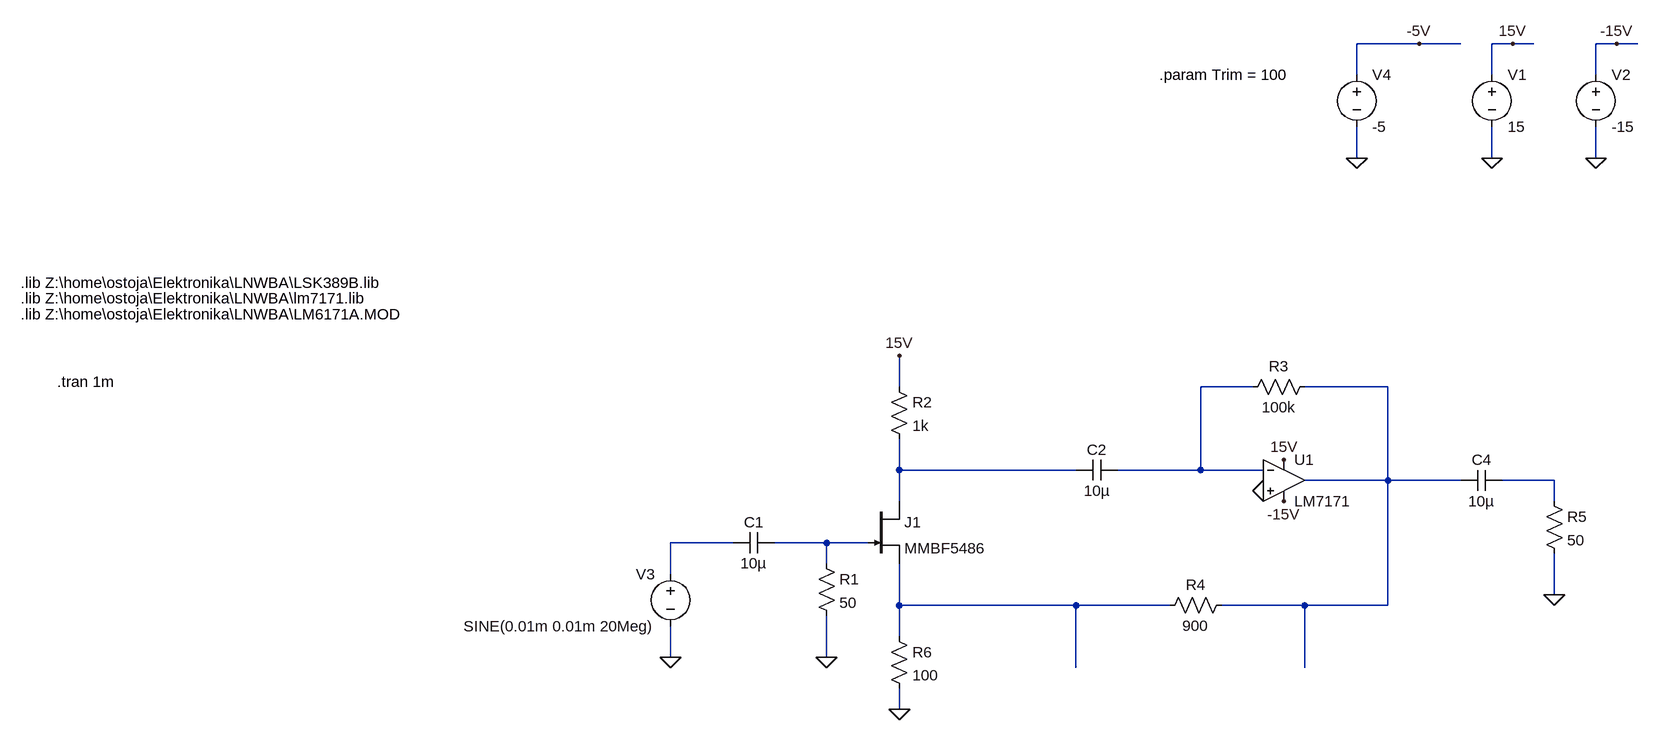
[diagram p0: schematic LNWBA_j111.asc]
LNWBA_j111.asc, the LTspice schematic file:
Version 4
SHEET 1 2516 804
WIRE 960 -592 864 -592
WIRE 1024 -592 960 -592
WIRE 1104 -592 1072 -592
WIRE 1136 -592 1104 -592
WIRE 1264 -592 1232 -592
WIRE 1296 -592 1264 -592
WIRE 864 -544 864 -592
WIRE 1072 -544 1072 -592
WIRE 1232 -544 1232 -592
WIRE 864 -416 864 -464
WIRE 1072 -416 1072 -464
WIRE 1232 -416 1232 -464
WIRE 160 -64 160 -112
WIRE 704 -64 624 -64
WIRE 912 -64 784 -64
WIRE 160 64 160 16
WIRE 432 64 160 64
WIRE 624 64 624 -64
WIRE 624 64 496 64
WIRE 720 64 624 64
WIRE 912 80 912 -64
WIRE 912 80 784 80
WIRE 1024 80 912 80
WIRE 1168 80 1088 80
WIRE 160 112 160 64
WIRE 1168 112 1168 80
WIRE -96 176 -192 176
WIRE 48 176 -32 176
WIRE 112 176 48 176
WIRE 48 208 48 176
WIRE -192 224 -192 176
WIRE 1168 256 1168 192
WIRE 160 272 160 208
WIRE 432 272 160 272
WIRE 576 272 432 272
WIRE 784 272 656 272
WIRE 912 272 912 80
WIRE 912 272 784 272
WIRE 160 320 160 272
WIRE -192 352 -192 304
WIRE 48 352 48 288
WIRE 432 368 432 272
WIRE 784 368 784 272
WIRE 160 432 160 400
FLAG 1104 -592 15V
FLAG 1264 -592 -15V
FLAG 1232 -416 0
FLAG 1072 -416 0
FLAG 160 -112 15V
FLAG -192 352 0
FLAG 752 48 15V
FLAG 752 112 -15V
FLAG 960 -592 -5V
FLAG 864 -416 0
FLAG 48 352 0
FLAG 160 432 0
FLAG 720 96 0
FLAG 1168 256 0
SYMBOL njf 112 112 R0
SYMATTR InstName J1
SYMATTR Value MMBF5486
SYMBOL voltage 1072 -560 R0
WINDOW 123 0 0 Left 0
WINDOW 39 0 0 Left 0
SYMATTR InstName V1
SYMATTR Value 15
SYMBOL voltage 1232 -560 R0
WINDOW 123 0 0 Left 0
WINDOW 39 0 0 Left 0
SYMATTR InstName V2
SYMATTR Value -15
SYMBOL voltage -192 208 M0
WINDOW 123 0 0 Left 0
WINDOW 39 0 0 Left 0
SYMATTR InstName V3
SYMATTR Value SINE(0.01m 0.01m 20Meg)
SYMBOL res 144 -80 R0
SYMATTR InstName R2
SYMATTR Value 1k
SYMBOL res 672 256 R90
WINDOW 0 0 56 VBottom 2
WINDOW 3 32 56 VTop 2
SYMATTR InstName R4
SYMATTR Value 900
SYMBOL voltage 864 -560 R0
WINDOW 123 0 0 Left 0
WINDOW 39 0 0 Left 0
SYMATTR InstName V4
SYMATTR Value -5
SYMBOL res 144 304 R0
SYMATTR InstName R6
SYMATTR Value 100
SYMBOL OpAmps\\opamp2 752 16 R0
SYMATTR InstName U1
SYMATTR Value LM7171
SYMBOL cap -32 160 R90
WINDOW 0 0 32 VBottom 2
WINDOW 3 32 32 VTop 2
SYMATTR InstName C1
SYMATTR Value 10µ
SYMBOL res 32 192 R0
SYMATTR InstName R1
SYMATTR Value 50
SYMBOL cap 496 48 R90
WINDOW 0 0 32 VBottom 2
WINDOW 3 32 32 VTop 2
SYMATTR InstName C2
SYMATTR Value 10µ
SYMBOL res 800 -80 R90
WINDOW 0 0 56 VBottom 2
WINDOW 3 32 56 VTop 2
SYMATTR InstName R3
SYMATTR Value 100k
SYMBOL cap 1088 64 R90
WINDOW 0 0 32 VBottom 2
WINDOW 3 32 32 VTop 2
SYMATTR InstName C4
SYMATTR Value 10µ
SYMBOL res 1152 96 R0
SYMATTR InstName R5
SYMATTR Value 50
TEXT -1192 -224 Left 2 !.lib Z:\\home\\ostoja\\Elektronika\\LNWBA\\LSK389B.lib
TEXT -1136 -72 Left 2 !.tran 1m
TEXT -1192 -200 Left 2 !.lib Z:\\home\\ostoja\\Elektronika\\LNWBA\\lm7171.lib
TEXT -1192 -176 Left 2 !.lib Z:\\home\\ostoja\\Elektronika\\LNWBA\\LM6171A.MOD
TEXT 560 -544 Left 2 !.param Trim = 100

The netlist it stands for:
* LNWBA_j111.asc
J1 N003 N006 N007 MMBF5486
V1 15V 0 15
V2 -15V 0 -15
V3 N005 0 SINE(0.01m 0.01m 20Meg)
R2 15V N003 1k
R4 N002 N007 900
V4 -5V 0 -5
R6 N007 0 100
XU1 0 N001 15V -15V N002 LM7171  ; pins In+ In- V+ V- OUT
C1 N006 N005 10µ
R1 N006 0 50
C2 N001 N003 10µ
R3 N002 N001 100k
C4 N004 N002 10µ
R5 N004 0 50
.model NJF NJF
.model PJF PJF
.lib standard.jft
.lib Z:\home\ostoja\Elektronika\LNWBA\LSK389B.lib
.tran 1m
.lib Z:\home\ostoja\Elektronika\LNWBA\lm7171.lib
.lib Z:\home\ostoja\Elektronika\LNWBA\LM6171A.MOD
.param Trim = 100
.backanno
.end